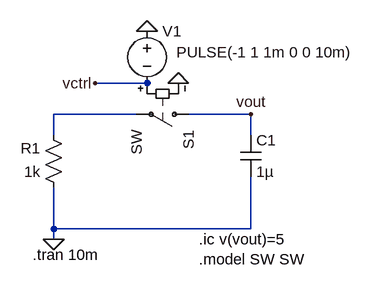
[diagram p0: schematic rc4.asc]
rc4.asc, the LTspice schematic file:
Version 4
SHEET 1 880 680
WIRE 176 64 96 64
WIRE 160 112 32 112
WIRE 336 112 240 112
WIRE 32 144 32 112
WIRE 336 144 336 112
WIRE 32 288 32 224
WIRE 336 288 336 208
WIRE 336 288 32 288
WIRE 32 304 32 288
FLAG 32 304 0
FLAG 336 112 vout
FLAG 224 64 0
FLAG 176 -16 0
FLAG 96 64 vctrl
SYMBOL res 48 240 R180
WINDOW 0 36 76 Left 2
WINDOW 3 36 40 Left 2
SYMATTR InstName R1
SYMATTR Value 1k
SYMBOL cap 320 144 R0
SYMATTR InstName C1
SYMATTR Value 1µ
SYMBOL sw 256 112 R90
SYMATTR InstName S1
SYMBOL voltage 176 -32 R0
WINDOW 3 45 48 Left 2
WINDOW 123 0 0 Left 0
WINDOW 39 0 0 Left 0
SYMATTR InstName V1
SYMATTR Value PULSE(-1 1 1m 0 0 10m)
TEXT 0 328 Left 2 !.tran 10m
TEXT 256 304 Left 2 !.ic v(vout)=5\n.model SW SW

The netlist it stands for:
* rc4.asc
R1 0 N001 1k
C1 vout 0 1µ
S1 vout N001 vctrl 0 SW
V1 0 vctrl PULSE(-1 1 1m 0 0 10m)
.tran 10m
.ic v(vout)=5
.model SW SW
.backanno
.end